# Altium schematic sheet [1]_IceZUM_Core_HX1K.SchDoc: Top Sheet
size A3; Author: Eladio Delgado Mingorance; CompanyName: Mareldem Technologies; Organization: Mareldem Technologies; Revision: 1.1; SheetNumber: 1; SheetTotal: 5
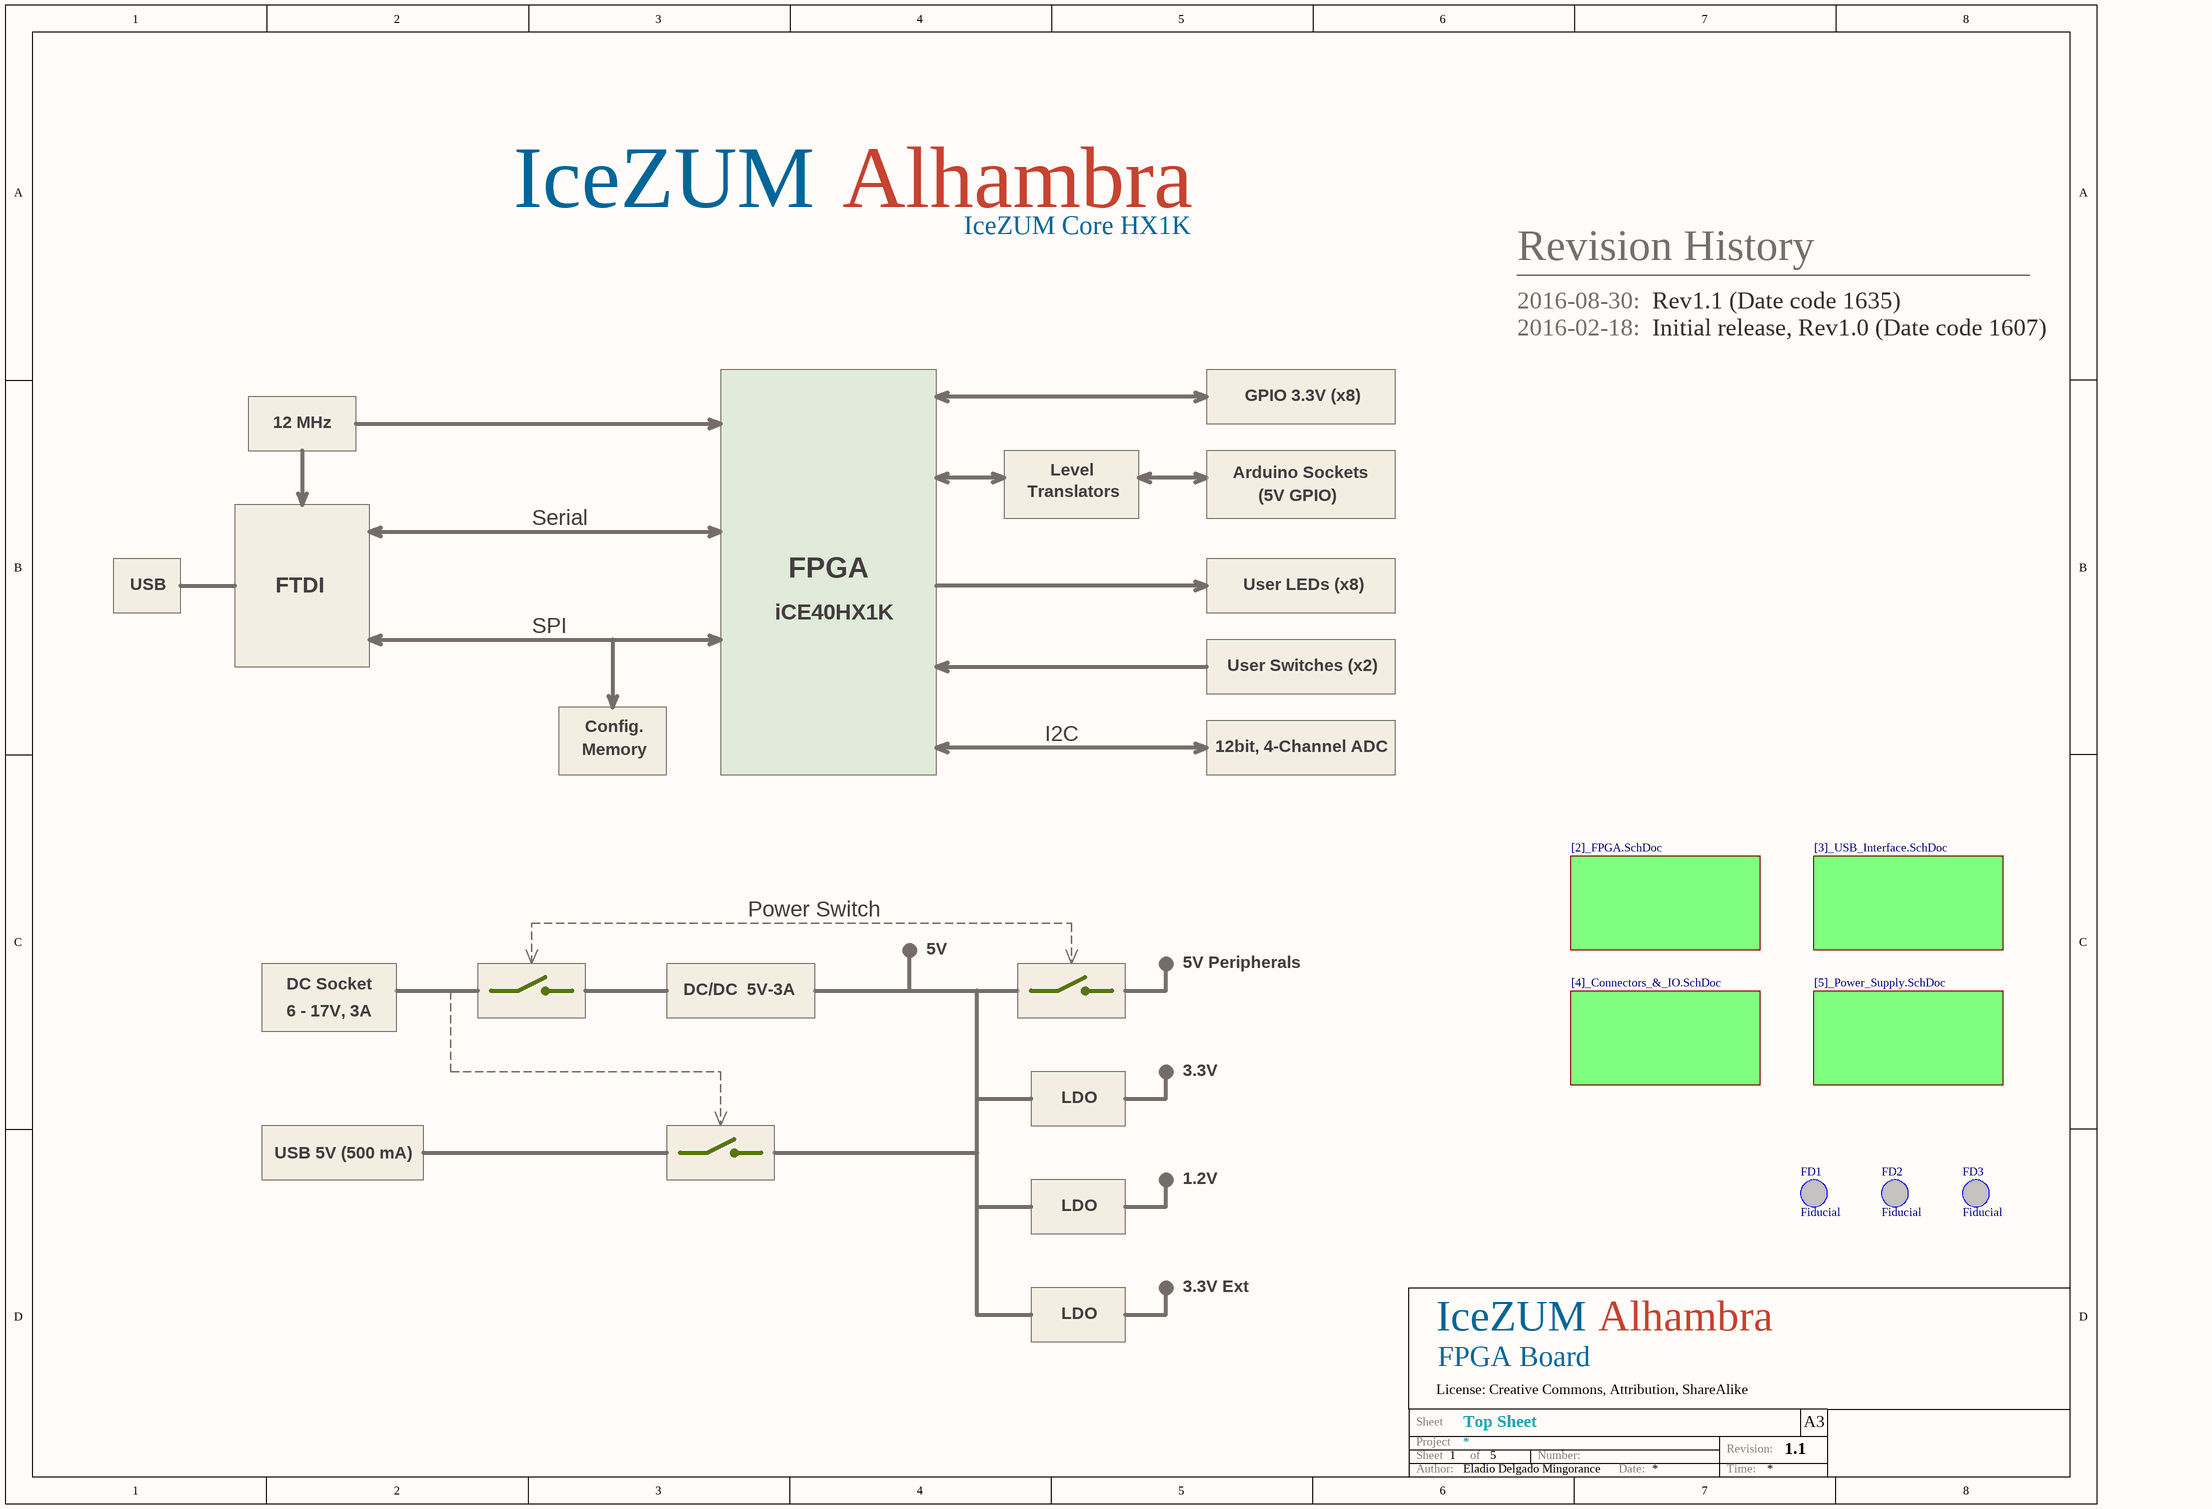
[diagram p0: [1]_IceZUM_Core_HX1K.SchDoc]

## Parts
FD1  Fiducial  [Fiducial]  (no BOM)
FD2  Fiducial  [Fiducial]  (no BOM)
FD3  Fiducial  [Fiducial]  (no BOM)

## Sub-sheets
[2]_FPGA.SchDoc = [2]_FPGA.SchDoc: no entries
[3]_USB_Interface.SchDoc = [3]_USB_Interface.SchDoc: no entries
[4]_Connectors_&_IO.SchDoc = [4]_Connectors_&_IO.SchDoc: no entries
[5]_Power_Supply.SchDoc = [5]_Power_Supply.SchDoc: no entries

## Notes on the sheet
- IceZUM
- Alhambra
- IceZUM Core HX1K
- Revision History
- 2016-08-30:
- Rev1.1 (Date code 1635)
- 2016-02-18:
- Initial release, Rev1.0 (Date code 1607)
- 12 MHz
- GPIO 3.3V (x8)
- Translators
- Level
- Arduino Sockets
- (5V GPIO)
- Serial
- FPGA
- USB
- FTDI
- SPI
- iCE40HX1K
- User LEDs (x8)
- User Switches (x2)
- Memory
- Config.
- I2C
- 12bit, 4-Channel ADC
- Power Switch
- DC Socket
- 5V
- 5V Peripherals
- 6 - 17V, 3A
- DC/DC  5V-3A
- LDO
- 3.3V
- USB 5V (500 mA)
- 1.2V
- 3.3V Ext
- License: Creative Commons, Attribution, ShareAlike
- FPGA Board
- Project
- Sheet
- Sheet         of
- Number:
- Revision:
- A3
- Author:
- Date:
- Time:

## Library data of the parts
FD1-FD3 = Fiducial: Part Number: Fiducial